# Altium schematic sheet Wireless_Shiled.SchDoc
size A4; SheetNumber: 1; SheetTotal: 2
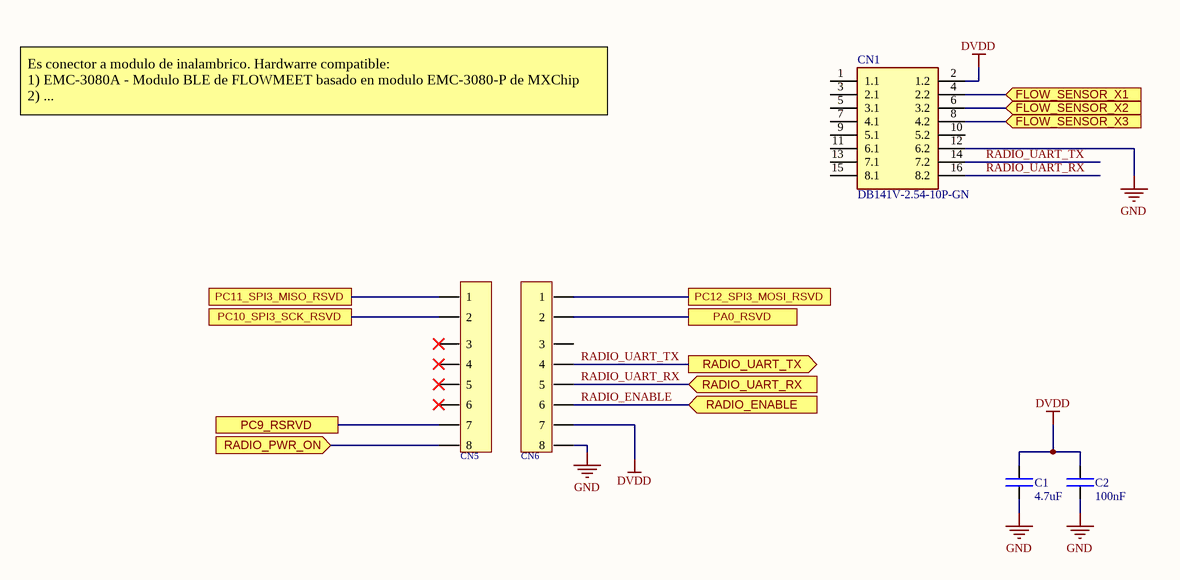
[diagram p0: Wireless_Shiled.SchDoc]

## Parts
C1  4.7uF  [CAP_SM0603_YAGEOCC2_N]
C2  100nF  [CAP_SM0603_YAGEOCC2_N]
CN1  DB141V-2.54-10P-GN  [SHDR16W90P508X254_2X8_2282X1260X1375P]
CN5  DW200R-11-08-43  [DW200R-11-08-43]  (value not drawn)
CN6  DW200R-11-08-43  [DW200R-11-08-43]  (value not drawn)

## Ports
FLOW_SENSOR_X1 (in), FLOW_SENSOR_X2 (in), FLOW_SENSOR_X3 (in), PA0_RSVD, PC9_RSRVD, PC10_SPI3_SCK_RSVD, PC11_SPI3_MISO_RSVD, PC12_SPI3_MOSI_RSVD, RADIO_ENABLE (in), RADIO_PWR_ON (in), RADIO_UART_RX (in), RADIO_UART_TX (out)

## Nets
DVDD: C1.1 C2.1 CN1.2(1.2) CN6.7
GND: C1.2 C2.2 CN1.12(6.2) CN6.8
FLOW_SENSOR_X1: CN1.4(2.2) ; port FLOW_SENSOR_X1
FLOW_SENSOR_X2: CN1.6(3.2) ; port FLOW_SENSOR_X2
FLOW_SENSOR_X3: CN1.8(4.2) ; port FLOW_SENSOR_X3
PA0_RSVD: CN6.2 ; port PA0_RSVD
PC9_RSRVD: CN5.7 ; port PC9_RSRVD
PC10_SPI3_SCK_RSVD: CN5.2 ; port PC10_SPI3_SCK_RSVD
PC11_SPI3_MISO_RSVD: CN5.1 ; port PC11_SPI3_MISO_RSVD
PC12_SPI3_MOSI_RSVD: CN6.1 ; port PC12_SPI3_MOSI_RSVD
RADIO_ENABLE: CN6.6 ; port RADIO_ENABLE
RADIO_PWR_ON: CN5.8 ; port RADIO_PWR_ON
RADIO_UART_RX: CN1.16(8.2) CN6.5 ; port RADIO_UART_RX
RADIO_UART_TX: CN1.14(7.2) CN6.4 ; port RADIO_UART_TX

Not connected (* = marked no-connect by the designer): CN1 1(1.1) 3(2.1) 5(3.1) 7(4.1) 9(5.1) 10(5.2) 11(6.1) 13(7.1) 15(8.1); CN5 3* 4* 5* 6*; CN6 3

## Notes on the sheet
- Es conector a modulo de inalambrico. Hardwarre compatible:
  1) EMC-3080A - Modulo BLE de FLOWMEET basado en modulo EMC-3080-P de MXChip
  2) ...

## Library data of the parts
C1 = CC0603KRX5R6BB475: CAP 4.7uF SM0603 X7R 16V YAGEO; Manufacturer Part Number: CC0603JRX7R7BB473; Tolerance: 10; Category: Capacitor; Manufacturer: Yageo; Package: 0603; Value: 4.7uF; ComponentLink1Description: Manufacturer Website; ComponentLink1URL: http://www.yageo.com
C2 = CC0603KRX7R9BB104: CAP 100nF SM0603 X7R 50V YAGEO CC2; Tolerance (%): 10; Voltage Rating (Volts): 50; Category: Capacitor; Manufacturer: Yageo; Manufacturer Part Number: CC0603KRX7R9BB104; Package: 0603; Value: 100nF; Supplier Part Number 1: 1362556; Supplier 1: Farnell; ComponentLink1URL: http://www.yageo.com; ComponentLink1Description: Manufacturer Website; Supplier 2: Digi-Key; Supplier Part Number 2: 311-1344-1-ND; Datasheet: https://datasheet.lcsc.com/lcsc/2211101700_YAGEO-CC0603KRX7R9BB104_C14663.pdf
CN1 = DB141V-2.54-10P-GN: PCB terminal block, nominal current: 6 A, rated voltage (III/2): 160 V, nominal cross section: 0.5 mm?, Number of potentials: 8, Number of rows: 1, Number of positions per row: 8, product range: FFKDS(A) 0,5/..-V, pitch: 2.54 mm, connection method: Push-in spring connection, mounting: Wave soldering, conductor/PCB connection direction: 90 ?, color: green, Pin layout: Linear double pinning, Solder pin [P]: 3.4 mm, type of packaging: packed in cardboard. The article can be aligned to create different nos. of; Manufacturer: Dorabo; Vendor Part Number: C2898752; Vendor: LCSC; Manufacturer Part Number: DB141V-2.54-10P-GN; Price: 0.82
CN5 CN6 = DW200R-11-08-43: 1 x 8 - tru hole 2mm - altura 4.3mm; Manufacturer: Dealon; Vendor: LCSC; Manufacturer Part Number: DW200R-11-08-43